# EAGLE design capstone electrical circuit rev3 (EAGLE 9.6.2)
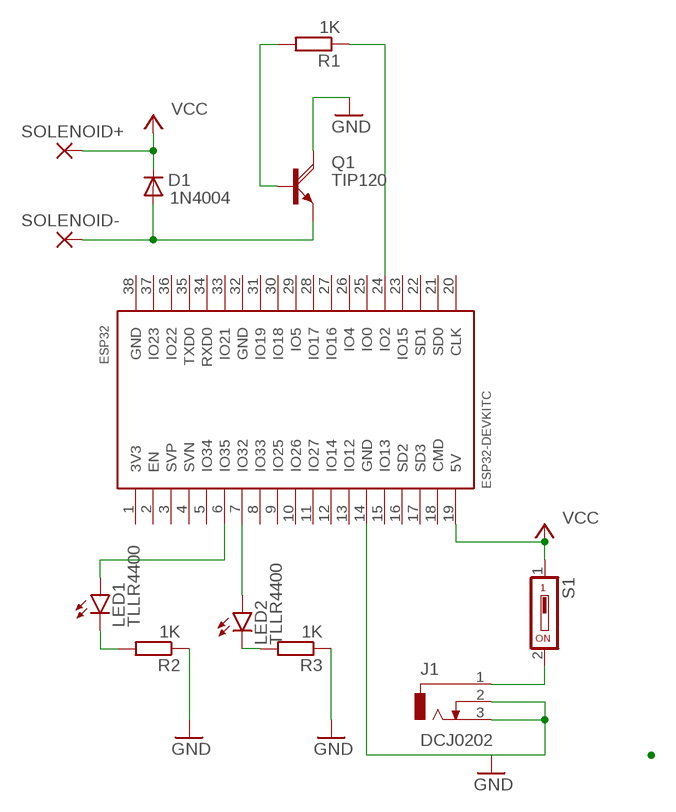
[diagram p0: schematic, sheet 1]

## Parts
D1  1N4004  [DO41-10]
ESP32  ESP32DEVKITC  [ESP32-DEVKITC]
J1  DCJ0202  [DCJ0202]
LED1  TLLR4400  [LED3MM]
LED2  TLLR4400  [LED3MM]
Q1  TIP120  [TO220AH]
R1  1K  R-EU_0207/10  [0207/10]
R2  1K  R-EU_0207/10  [0207/10]
R3  1K  R-EU_0207/10  [0207/10]
S1  SD4-01  [SD4-01]
SOLENOID+  WIREPAD2,54/1,0  [2,54/1,0]
SOLENOID-  WIREPAD2,54/1,0  [2,54/1,0]

## Nets
GND: ESP32.14(GND) J1.2 J1.3 Q1.C R2.1 R3.1
N$1: J1.1 S1.2
N$2: LED1.K(C) R2.2
N$3: D1.A Q1.E SOLENOID-.1(P)
N$5: Q1.B R1.2
N$6: ESP32.24(IO2) R1.1
N$7: LED2.K(C) R3.2
N$8: ESP32.7(IO32) LED2.A
N$9: ESP32.6(IO35) LED1.A
VCC: D1.C ESP32.19(5V) S1.1 SOLENOID+.1(P)
Unconnected: ESP32.1(3V3) ESP32.2(EN) ESP32.3(SVP) ESP32.4(SVN) ESP32.5(IO34) ESP32.8(IO33) ESP32.9(IO25) ESP32.10(IO26) ESP32.11(IO27) ESP32.12(IO14) ESP32.13(IO12) ESP32.15(IO13) ESP32.16(SD2) ESP32.17(SD3) ESP32.18(CMD) ESP32.20(CLK) ESP32.21(SD0) ESP32.22(SD1) ESP32.23(IO15) ESP32.25(IO0) ESP32.26(IO4) ESP32.27(IO16) ESP32.28(IO17) ESP32.29(IO5) ESP32.30(IO18) ESP32.31(IO19) ESP32.32(GND) ESP32.33(IO21) ESP32.34(RXD0) ESP32.35(TXD0) ESP32.36(IO22) ESP32.37(IO23) ESP32.38(GND)

## Library data of the parts
D1 = adafruit:1N4004: DIODE General purpose 1N400x type rectifier (With bigger pads) http://www.ladyada.net/library/pcb/eaglelibrary.html
ESP32 = ESP32-DEVKITC:ESP32DEVKITC
J1 = con-jack:DCJ0202: DC POWER JACK Source: DCJ0202.pdf; OC_FARNELL: unknown; OC_NEWARK: unknown
LED1 LED2 = led:TLLR4400: Low Current (2mA) LED 3 mm Tinted Diffused Package color RED Source: Data sheet <http://www.farnell.com/datasheets/391100.pdf>; MF: VISHAY SEMICONDUCTOR; OC_FARNELL: 1612437
Q1 = transistor-power:TIP120: NPN DARLINGTON TRANSISTOR
R1-R3 = rcl:R-EU_: RESISTOR, European symbol; SPICEPREFIX: R
S1 = switch-dil:SD4-01: DIL/CODE SWITCH; OC_FARNELL: unknown; OC_NEWARK: unknown
SOLENOID+ SOLENOID- = wirepad:WIREPAD: Wire PAD connect wire on PCB

## Board
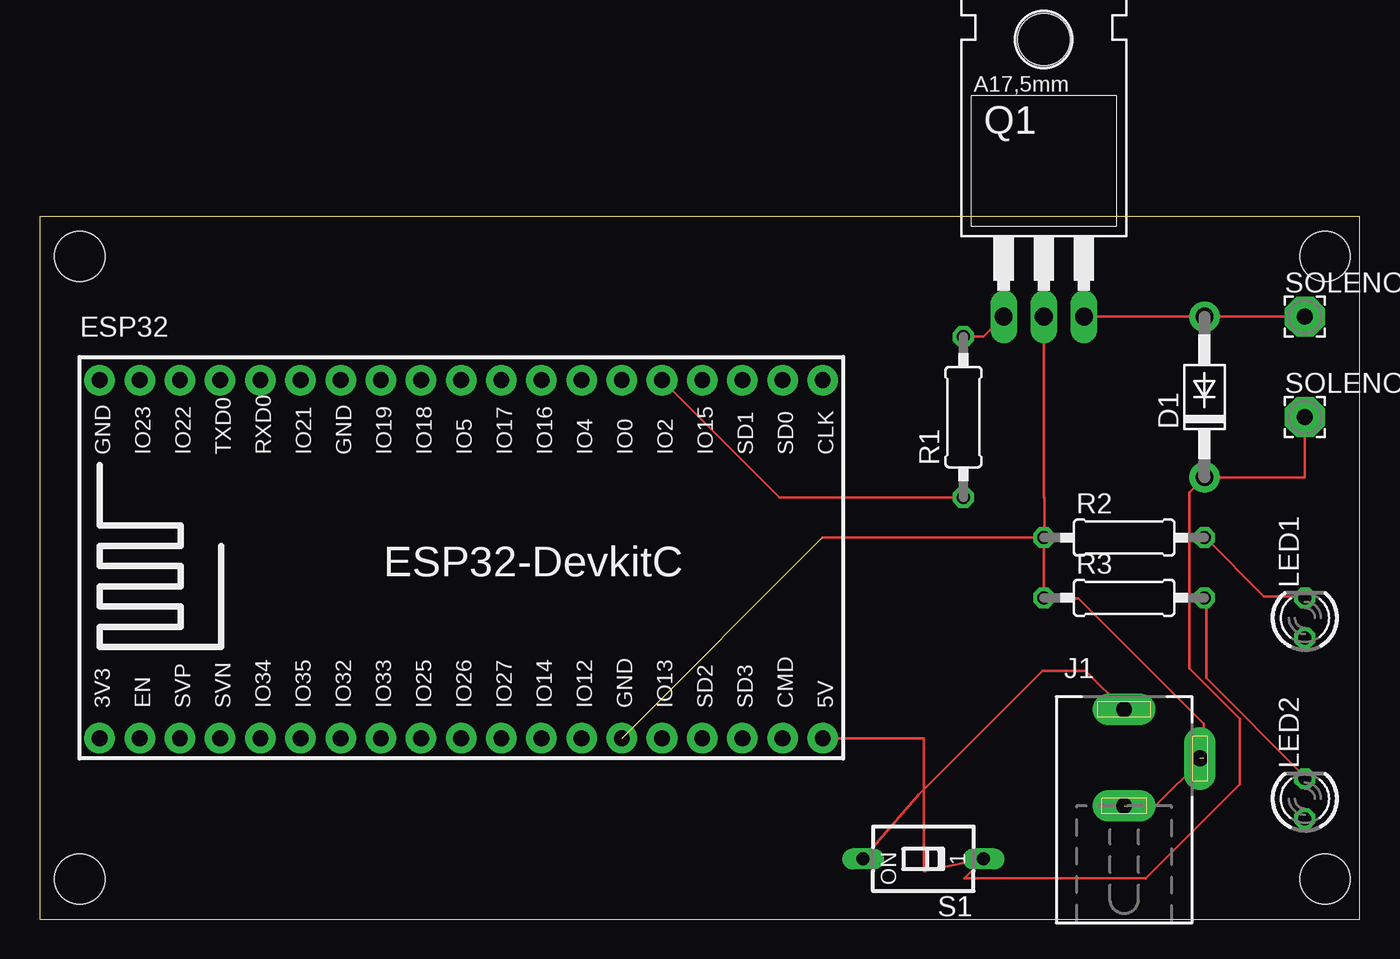
[diagram p1: board, top side]
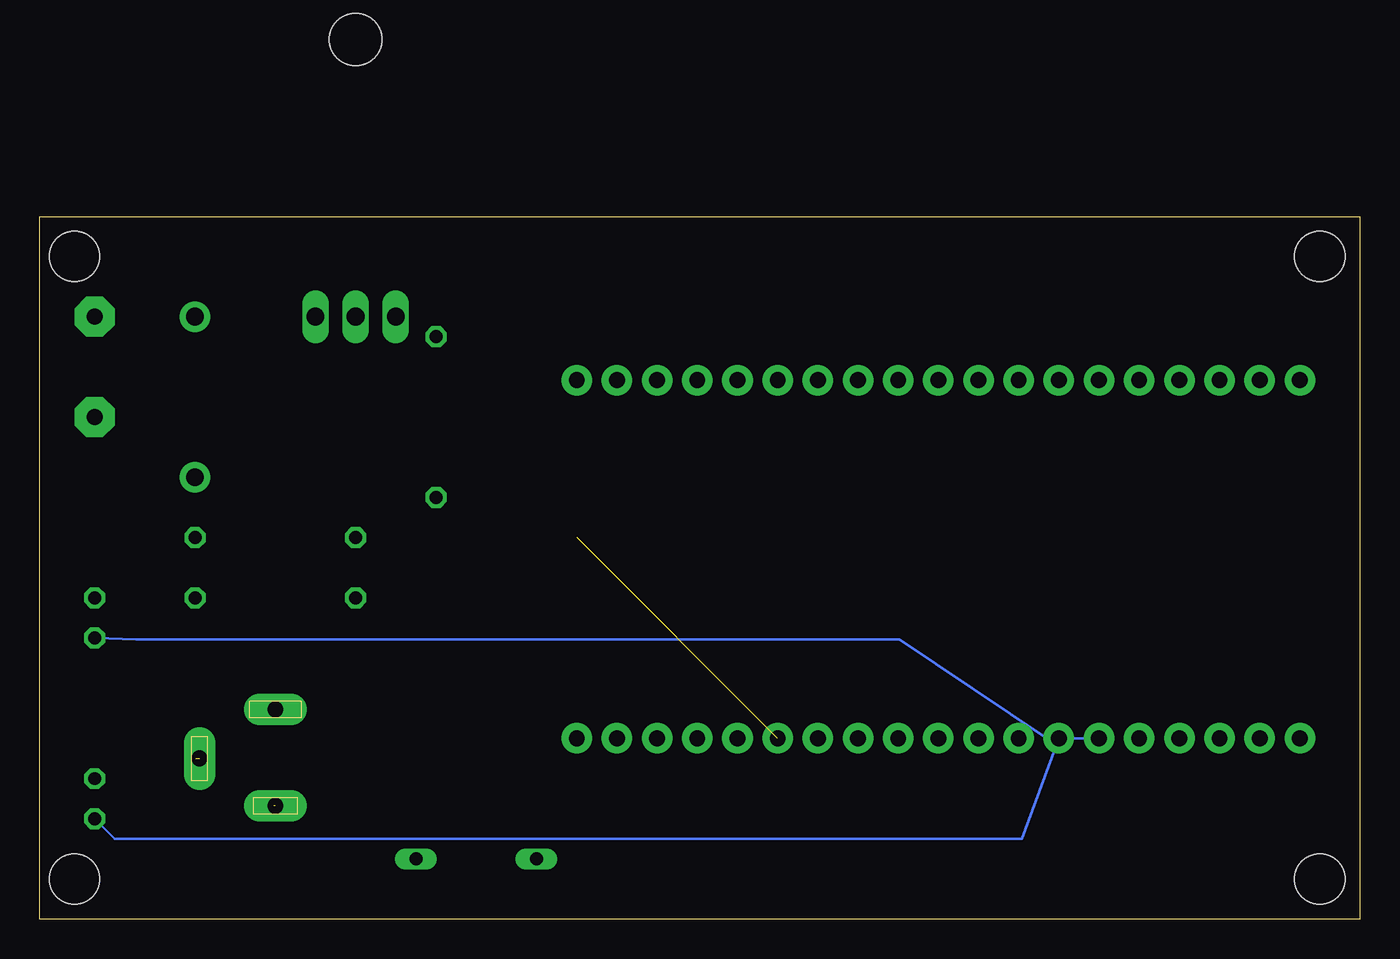
[diagram p2: board, bottom side, seen from below]

Size 83.49 x 44.44 mm. Coordinates in mm from the lower left corner, seen from the top.
Outline: 0,0 83.49,0 83.49,44.44 0,44.44 0,0
Copper layers (1*16): Top 0.035mm / dielectric 1.5mm / Bottom 0.035mm
Design rules "default": minimum track width 6mil, minimum drill 0.35mm, track to track 6mil, track to pad 6mil, pad to pad 6mil, via to via 6mil, smd to smd 6mil, copper to edge 40mil, drill to drill 6mil, minimum pad ring 10mil, minimum via ring 8mil, stop-mask expansion 4mil, vias tented up to drill 0mil, thermal gap 10mil
Holes 3.17 mm at 2.54,41.91 2.54,2.54 81.28,41.91 81.28,2.54

### Footprints (pad centres in the part's own frame; a part is rotated, then mirrored left to right if it is on the bottom)
DO41-10 = drill 1.118 pad 1.93: A 5.08,0; C -5.08,0
ESP32-DEVKITC = drill 1 pad 1.93: 1 -22.87,-11.42; 2 -20.33,-11.42; 3 -17.79,-11.42; 4 -15.25,-11.42; 5 -12.71,-11.42; 6 -10.17,-11.42; 7 -7.63,-11.42; 8 -5.09,-11.42; 9 -2.55,-11.42; 10 -0.01,-11.42; 11 2.53,-11.42; 12 5.07,-11.42; 13 7.61,-11.42; 14 10.15,-11.42; 15 12.69,-11.42; 16 15.23,-11.42; 17 17.77,-11.42; 18 20.31,-11.42; 19 22.85,-11.42; 20 22.85,11.23; 21 20.31,11.23; 22 17.77,11.23; 23 15.23,11.23; 24 12.69,11.23; 25 10.15,11.23; 26 7.61,11.23; 27 5.07,11.23; 28 2.53,11.23; 29 -0.01,11.23; 30 -2.55,11.23; 31 -5.09,11.23; 32 -7.63,11.23; 33 -10.17,11.23; 34 -12.71,11.23; 35 -15.25,11.23; 36 -17.79,11.23; 37 -20.33,11.23; 38 -22.87,11.23
DCJ0202 = drill 1 pad 2 long: 1 0,3.1; 2 4.8,0; 3 0,-3
LED3MM = drill 0.813 octagon: A -1.27,0; K 1.27,0
TO220AH = drill 1.118 long: B -2.54,-6.35; C 0,-6.35; E 2.54,-6.35 | hole 3.302: 0,11.176
0207/10 = drill 0.813 octagon: 1 -5.08,0; 2 5.08,0
SD4-01 = drill 0.813 long: 1 0,-3.81; 2 0,3.81
2,54/1,0 = drill 1.016 pad 2.54 octagon: 1 0,0

### Placement (x,y rotation side)
D1  73.66,33.02 90 top
ESP32  26.67,22.86 0 top
J1  68.58,10.16 0 top
LED1  80.01,19.05 90 top
LED2  80.01,7.62 90 top
Q1  63.5,44.45 0 top
R1  58.42,31.75 90 top
R2  68.58,24.13 0 top
R3  68.58,20.32 0 top
S1  55.88,3.81 90 top
SOLENOID+  80.01,31.75 0 top
SOLENOID-  80.01,38.1 0 top

### Tracks (layer width: path | path; a pad name or v marks a point on that pad's centre or on a via)
GND  (3 unrouted)
  Top 0.152: 49.51,24.13 R2.1 | Q1.C 63.5,26.67 63.55,26.67 63.55,24.13 R2.1 | 73.61,10.21 73.61,10.16 | R2.1 R3.1 63.55,20.27 65.68,20.27 73.61,12.34 73.61,10.21 | 68.68,7.16 70.56,7.16 73.61,10.21
N$1
  Top 0.152: S1.2 55.6,7.9 63.4,15.7 66.11,15.7 J1.1
N$2
  Top 0.152: LED1.K 80.01,20.42 77.42,20.42 73.76,24.08 R2.2
N$3
  Top 0.152: SOLENOID-.1 D1.A Q1.E
N$5
  Top 0.152: Q1.B 59.69,36.83 R1.2
N$6
  Top 0.152: R1.1 46.78,26.67 ESP32.24
N$7
  Top 0.152: R3.2 73.76,20.27 73.76,15.24 80.01,8.99 LED2.K
N$8
  Bottom 0.152: LED2.A 78.74,5.08 21.36,5.08 ESP32.7
N$9
  Bottom 0.152: LED1.A 77.37,17.68 29.11,17.68 19.81,11.44 ESP32.6
VCC
  Top 0.152: SOLENOID+.1 80.01,27.94 D1.C 72.69,26.98 72.69,15.85 75.89,12.65 75.89,8.53 69.95,2.59 58.49,2.59 S1.1 55.93,3.02 55.93,11.44 ESP32.19